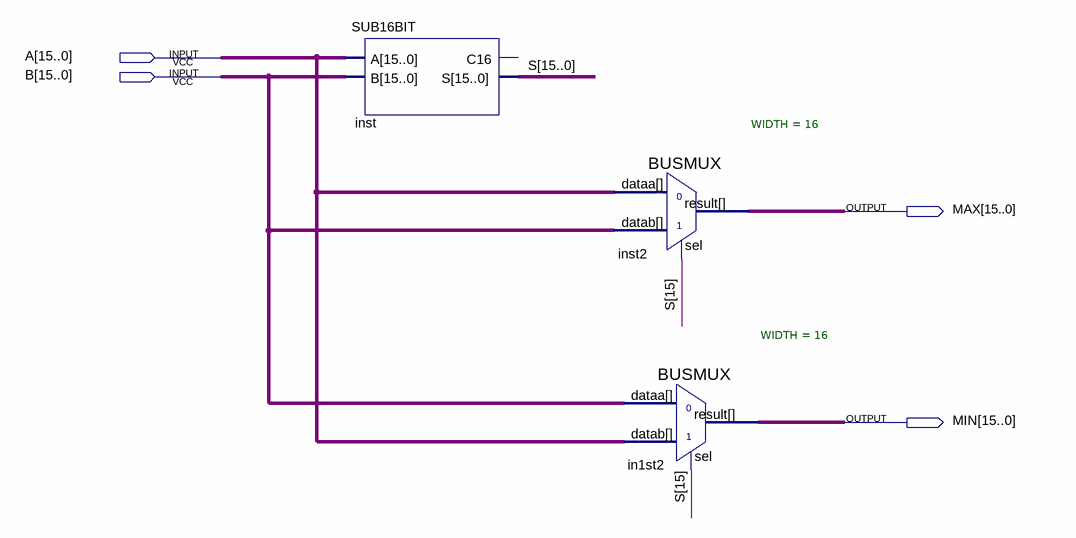
[diagram p0: schematic sheet]
// Quartus schematic MINMAX.bdf as structural Verilog: 3 symbols, 4 pins
module MINMAX (
  input  [15:0] A,
  input  [15:0] B,
  output [15:0] MAX,
  output [15:0] MIN
);

  wire [15:0] S;

  SUB16BIT inst (.A(A), .B(B), .S(S));  // open: C16
  BUSMUX #(.WIDTH(16)) inst2 (.datab(B), .sel(S[15]), .dataa(A), .result(MAX));
  BUSMUX #(.WIDTH(16)) in1st2 (.datab(A), .sel(S[15]), .dataa(B), .result(MIN));
endmodule
